# Altium schematic sheet LM2596-4V.SchDoc: LM2596-4V
size A4; CompanyName: github.com/aKaReZa75; Revision: 1.0; SheetNumber: 10; SheetTotal: 10; Project_Name: Design Template
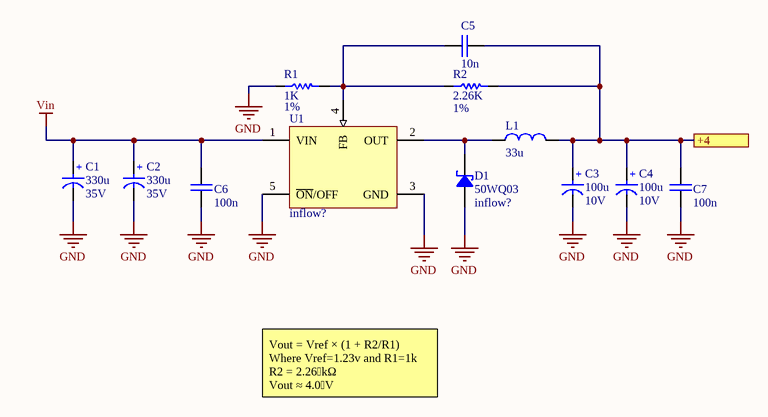
[diagram p0: LM2596-4V.SchDoc]

## Parts
C1  Rating: 35V  [CAP ALUM 10.3MM]  (hidden comment: 330u)
C2  Rating: 35V  [CAP ALUM 10.3MM]  (hidden comment: 330u)
C3  Rating: 10V  [CAP ALUM 10.3MM]  (hidden comment: 100u)
C4  Rating: 10V  [CAP ALUM 10.3MM]  (hidden comment: 100u)
C5  10n  [CAP 1206/3216]
C6  100n  [CAP 1206/3216]
C7  100n  [CAP 1206/3216]
D1  Inflow: inflow?  [50WQ03]  (hidden comment: 50WQ03)
L1  33u  [L_12]
R1  Type: 1%  [Res-(1/4)]  (hidden comment: 1K)
R2  Type: 1%  [Res-(1/4)]  (hidden comment: 2.26K)
U1  Inflow: inflow?  [D2PAK_TO-263-5]  (hidden comment: Adj)

## Ports
+4

## Nets
GND: C1.2(-) C2.2(-) C3.2(-) C4.2(-) C6.2 C7.2 D1.1 R1.1 U1.3(GND) U1.5(~{ON}/OFF)
Vin: C1.1(+) C2.1(+) C6.1 U1.1(VIN)
+4: C3.1(+) C4.1(+) C5.2 C7.1 L1.2 R2.2 ; port +4
NetC5_1: C5.1 R1.2 R2.1 U1.4(FB)
NetD1_2: D1.2 L1.1 U1.2(OUT)

## Notes on the sheet
- Vout = Vref × (1 + R2/R1)
  Where Vref=1.23v and R1=1k
  R2 = 2.26 kΩ
  Vout ≈ 4.0 V
- Title:
- Project:
- Drawn by:
- Revision:
- Hossein Bagheri
- Company:
- Sheet
- of

## Library data of the parts
C1-C4 = Cap_Electrolit_SMD: Electrolit Capacitor SMD; Inflow: inflow?; Type: Electrolit; Package: SMD
  C1 C2: Value: 330u
  C3 C4: Value: 100u
C5-C7 = Cap_Multi_SMD_100nF_1206: Bipolar ceramic capacitor SMD; Type: MultiLayer; Inflow: inflow?; Rating: 50V; Validation: Valid; Package: 1206
  C5: Value: 10n
  C6 C7: Value: 100n
D1 = Semi_Diod_Sch_50WQ03: Fast soft recovery power rectifier; Rating: Rating?; Type: Schottky; Value: 50WQ03; Package: TO-252
L1 = Ind_SMD: Inductor; Inflow: inflow?; Type: Power; Rating: 3.5A; Value: 33u; Package: SMD
R1 R2 = Res_Dip_0.25: Resistor; Inflow: inflow?; Rating: 0.25W; Package: Package?
  R1: Value: 1K
  R2: Value: 2.26K
U1 = IC_Reg_LM2596: Simple switcher 3'A step-down voltage regulator; Rating: S; Value: Adj; Type: Switching; Package: TO-263